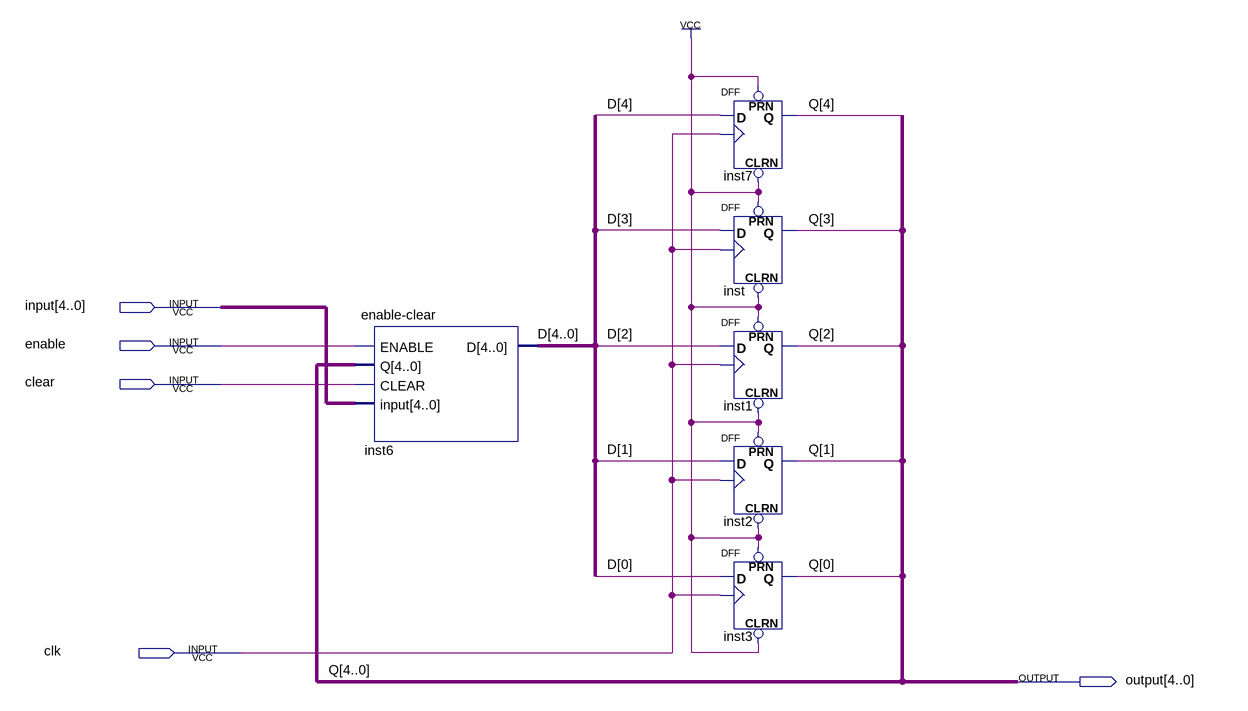
[diagram p0: schematic sheet]
// Quartus schematic reg4bitsNovo.bdf as structural Verilog: 6 symbols, 5 pins
module reg4bitsNovo (
  input  [4:0] \input ,
  input  enable,
  input  clear,
  input  clk,
  output [4:0] \output 
);

  wire [4:0] D;

  \enable-clear  inst6 (.ENABLE(enable), .Q(\output ), .CLEAR(clear), .\input (\input ), .D(D));
  DFF inst7 (.CLRN(1'b1), .CLK(clk), .D(D[4]), .PRN(1'b1), .Q(\output [4]));
  DFF inst (.CLRN(1'b1), .CLK(clk), .D(D[3]), .PRN(1'b1), .Q(\output [3]));
  DFF inst1 (.CLRN(1'b1), .CLK(clk), .D(D[2]), .PRN(1'b1), .Q(\output [2]));
  DFF inst2 (.CLRN(1'b1), .CLK(clk), .D(D[1]), .PRN(1'b1), .Q(\output [1]));
  DFF inst3 (.CLRN(1'b1), .CLK(clk), .D(D[0]), .PRN(1'b1), .Q(\output [0]));

  // Other names for the same wires on the sheet: Q[4:0] = \output 
endmodule
